# Altium schematic sheet laderegler.SchDoc
size A4; Organization: Altium Limited; Address1: L3, 12a Rodborough Rd; Address2: Frenchs Forest; Address3: NSW; Address4: Australia 2086
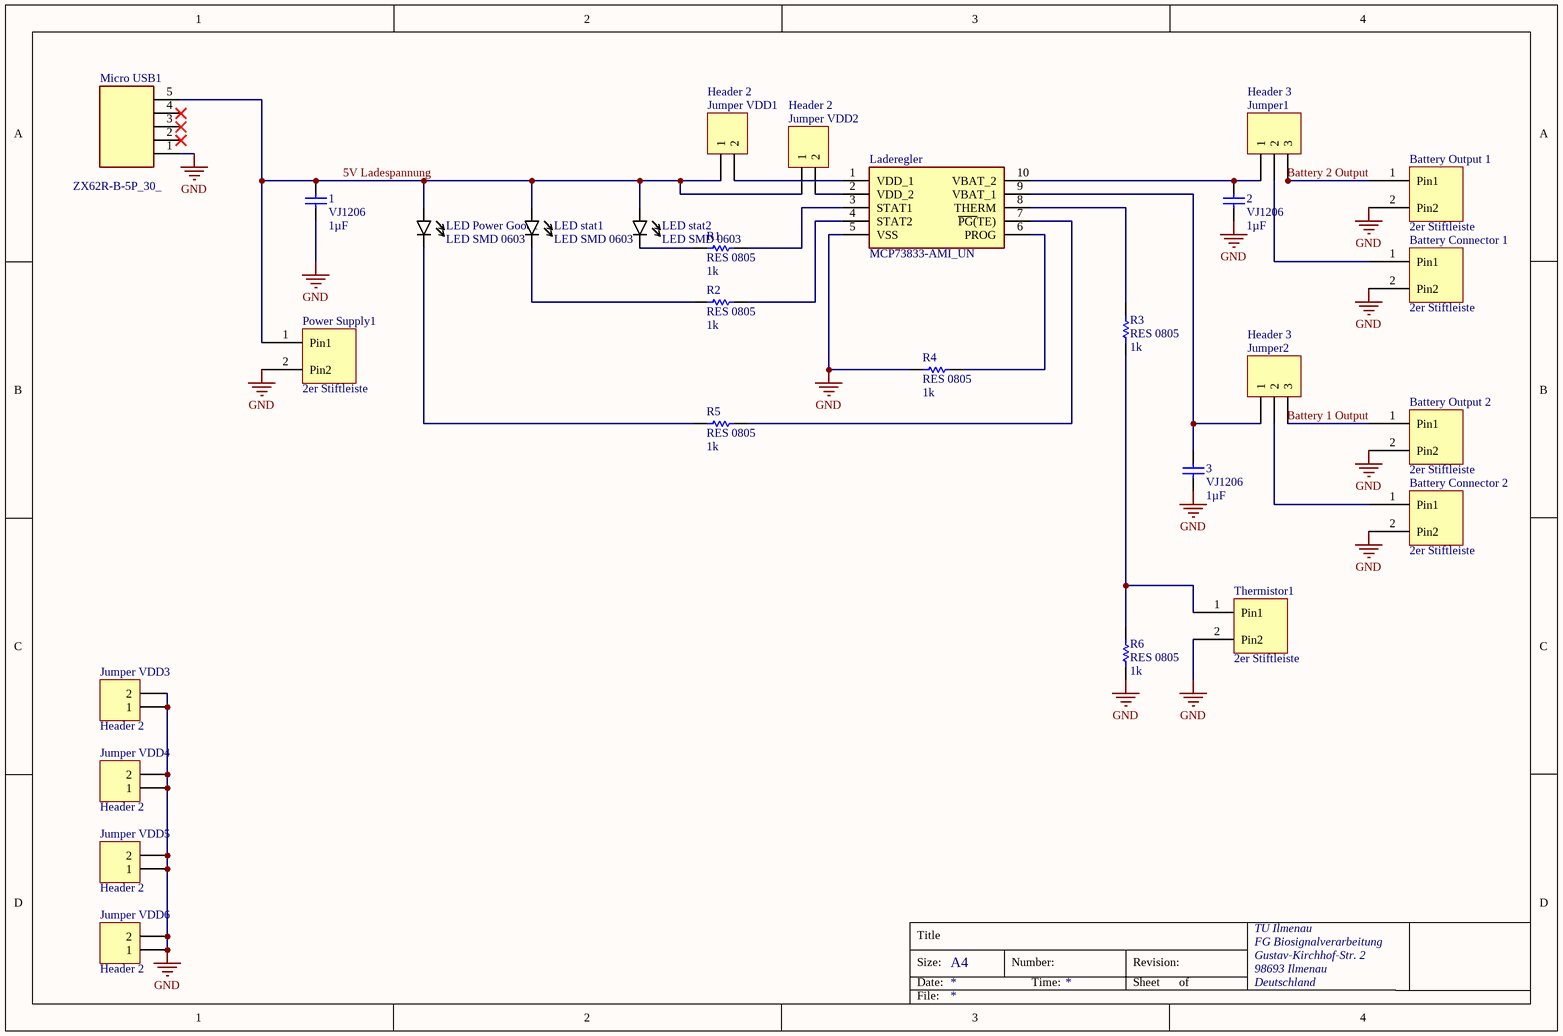
[diagram p0: laderegler.SchDoc]

## Parts
1  VJ1206  value 1µF  [VJ1206]
2  VJ1206  value 1µF  [VJ1206]
3  VJ1206  value 1µF  [VJ1206]
Battery_Connector_1  2er Stiftleiste  [2er Stiftleiste WR-WTB]
Battery_Connector_2  2er Stiftleiste  [2er Stiftleiste WR-WTB]
Battery_Output_1  2er Stiftleiste  [2er Stiftleiste WR-WTB]
Battery_Output_2  2er Stiftleiste  [2er Stiftleiste WR-WTB]
Jumper1  Header 3  [HDR1X3]
Jumper2  Header 3  [HDR1X3]
Jumper_VDD1  Header 2  [HDR1X2]
Jumper_VDD2  Header 2  [HDR1X2]
Jumper_VDD3  Header 2  [HDR1X2]
Jumper_VDD4  Header 2  [HDR1X2]
Jumper_VDD5  Header 2  [HDR1X2]
Jumper_VDD6  Header 2  [HDR1X2]
Laderegler  MCP73833-AMI_UN  [SOP50P490X110-10N]
LED_Power_Good1  LED SMD 0603  [SMD LED 0603]
LED_stat1  LED SMD 0603  [SMD LED 0603]
LED_stat2  LED SMD 0603  [SMD LED 0603]
Micro_USB1  ZX62R-B-5P_30_  [ZX62R-B-5P(30)]
Power_Supply1  2er Stiftleiste  [2er Stiftleiste WR-WTB]
R1  RES 0805  value 1k  [D12CRCW0805]
R2  RES 0805  value 1k  [D12CRCW0805]
R3  RES 0805  value 1k  [D12CRCW0805]
R4  RES 0805  value 1k  [D12CRCW0805]
R5  RES 0805  value 1k  [D12CRCW0805]
R6  RES 0805  value 1k  [D12CRCW0805]
Thermistor1  2er Stiftleiste  [2er Stiftleiste WR-WTB]

## Nets
GND: 1.2 2.2 3.2 Battery_Connector_1.2(Pin2) Battery_Connector_2.2(Pin2) Battery_Output_1.2(Pin2) Battery_Output_2.2(Pin2) Jumper_VDD3.1 Jumper_VDD3.2 Jumper_VDD4.1 Jumper_VDD4.2 Jumper_VDD5.1 Jumper_VDD5.2 Jumper_VDD6.1 Jumper_VDD6.2 Laderegler.5(VSS) Micro_USB1.1 Power_Supply1.2(Pin2) R4.1 R6.1 Thermistor1.2(Pin2)
5V Ladespannung: 1.1 Jumper_VDD1.1 Jumper_VDD2.1 LED_Power_Good1.1 LED_stat1.1 LED_stat2.1 Micro_USB1.5 Power_Supply1.1(Pin1)
Battery 2 Output: Battery_Output_1.1(Pin1) Jumper1.3
Net2_1: 2.1 Jumper1.1 Laderegler.10(VBAT_2)
Net3_1: 3.1 Jumper2.1 Laderegler.9(VBAT_1)
NetBattery_Connector_1_1: Battery_Connector_1.1(Pin1) Jumper1.2
NetBattery_Connector_2_1: Battery_Connector_2.1(Pin1) Jumper2.2
NetBattery_Output_2_1: Battery_Output_2.1(Pin1) Jumper2.3
NetJumper_VDD1_2: Jumper_VDD1.2 Laderegler.1(VDD_1)
NetJumper_VDD2_2: Jumper_VDD2.2 Laderegler.2(VDD_2)
NetLaderegler_3: Laderegler.3(STAT1) R1.2
NetLaderegler_4: Laderegler.4(STAT2) R2.2
NetLaderegler_6: Laderegler.6(PROG) R4.2
NetLaderegler_7: Laderegler.7(~{PG(}TE)) R5.2
NetLaderegler_8: Laderegler.8(THERM) R3.2
NetLED_Power_Good1_2: LED_Power_Good1.2 R5.1
NetLED_stat1_2: LED_stat1.2 R2.1
NetLED_stat2_2: LED_stat2.2 R1.1
NetR3_1: R3.1 R6.2 Thermistor1.1(Pin1)

Not connected (* = marked no-connect by the designer): Micro_USB1 2* 3* 4*

## Notes on the sheet
- Labels drawn without touching a wire or pin: Battery 1 Output
- Title
- Size:
- Date:
- A4
- Number:
- Time:
- Revision:
- Sheet
- of
- TU Ilmenau
- FG Biosignalverarbeitung
- Gustav-Kirchhof-Str. 2
- 98693 Ilmenau
- Deutschland
- File:

## Library data of the parts
1-3 = VJ1206: Ceramic Chip Capacitor Vishay Vitramon; Fitted: False
Battery_Connector_1 Battery_Connector_2 Battery_Output_1 Battery_Output_2 Power_Supply1 Thermistor1 = 2er Stiftleiste: 2er Stiftleiste WR-WTB 2,54mm
Jumper1 Jumper2 = Header 3: Header, 3-Pin; LatestRevisionDate: 17-Jul-2002; LatestRevisionNote: Re-released for DXP Platform.; Publisher: Altium Limited
Jumper_VDD1-Jumper_VDD6 = Header 2: Header, 2-Pin; LatestRevisionDate: 17-Jul-2002; LatestRevisionNote: Re-released for DXP Platform.; Publisher: Altium Limited
Laderegler = MCP73833-AMI_UN: Integrated Circuit; Manufacturer_Name: Microchip; Manufacturer_Part_Number: MCP73833-AMI/UN; Datasheet Link: https://componentsearchengine.com//MCP73833-AMI_UN.pdf; Height: 1.1mm; Mouser2 Part Number: 579-MCP73833-AMI/UN; Mouser2 Price/Stock: https://www.mouser.com/Search/Refine.aspx?Keyword=579-MCP73833-AMI%2FUN
Micro_USB1 = ZX62R-B-5P_30_: Connector; Manufacturer_Name: Hirose; Manufacturer_Part_Number: ZX62R-B-5P(30)
R1-R6 = RES 0805: Chip Resistor 0805; Fitted: False; Supplier 1: Farnell; Supplier Part Number 1: 1738935